# Altium project MSXV_BMS_Carrier_Board_Rev_2.1.PrjPcb
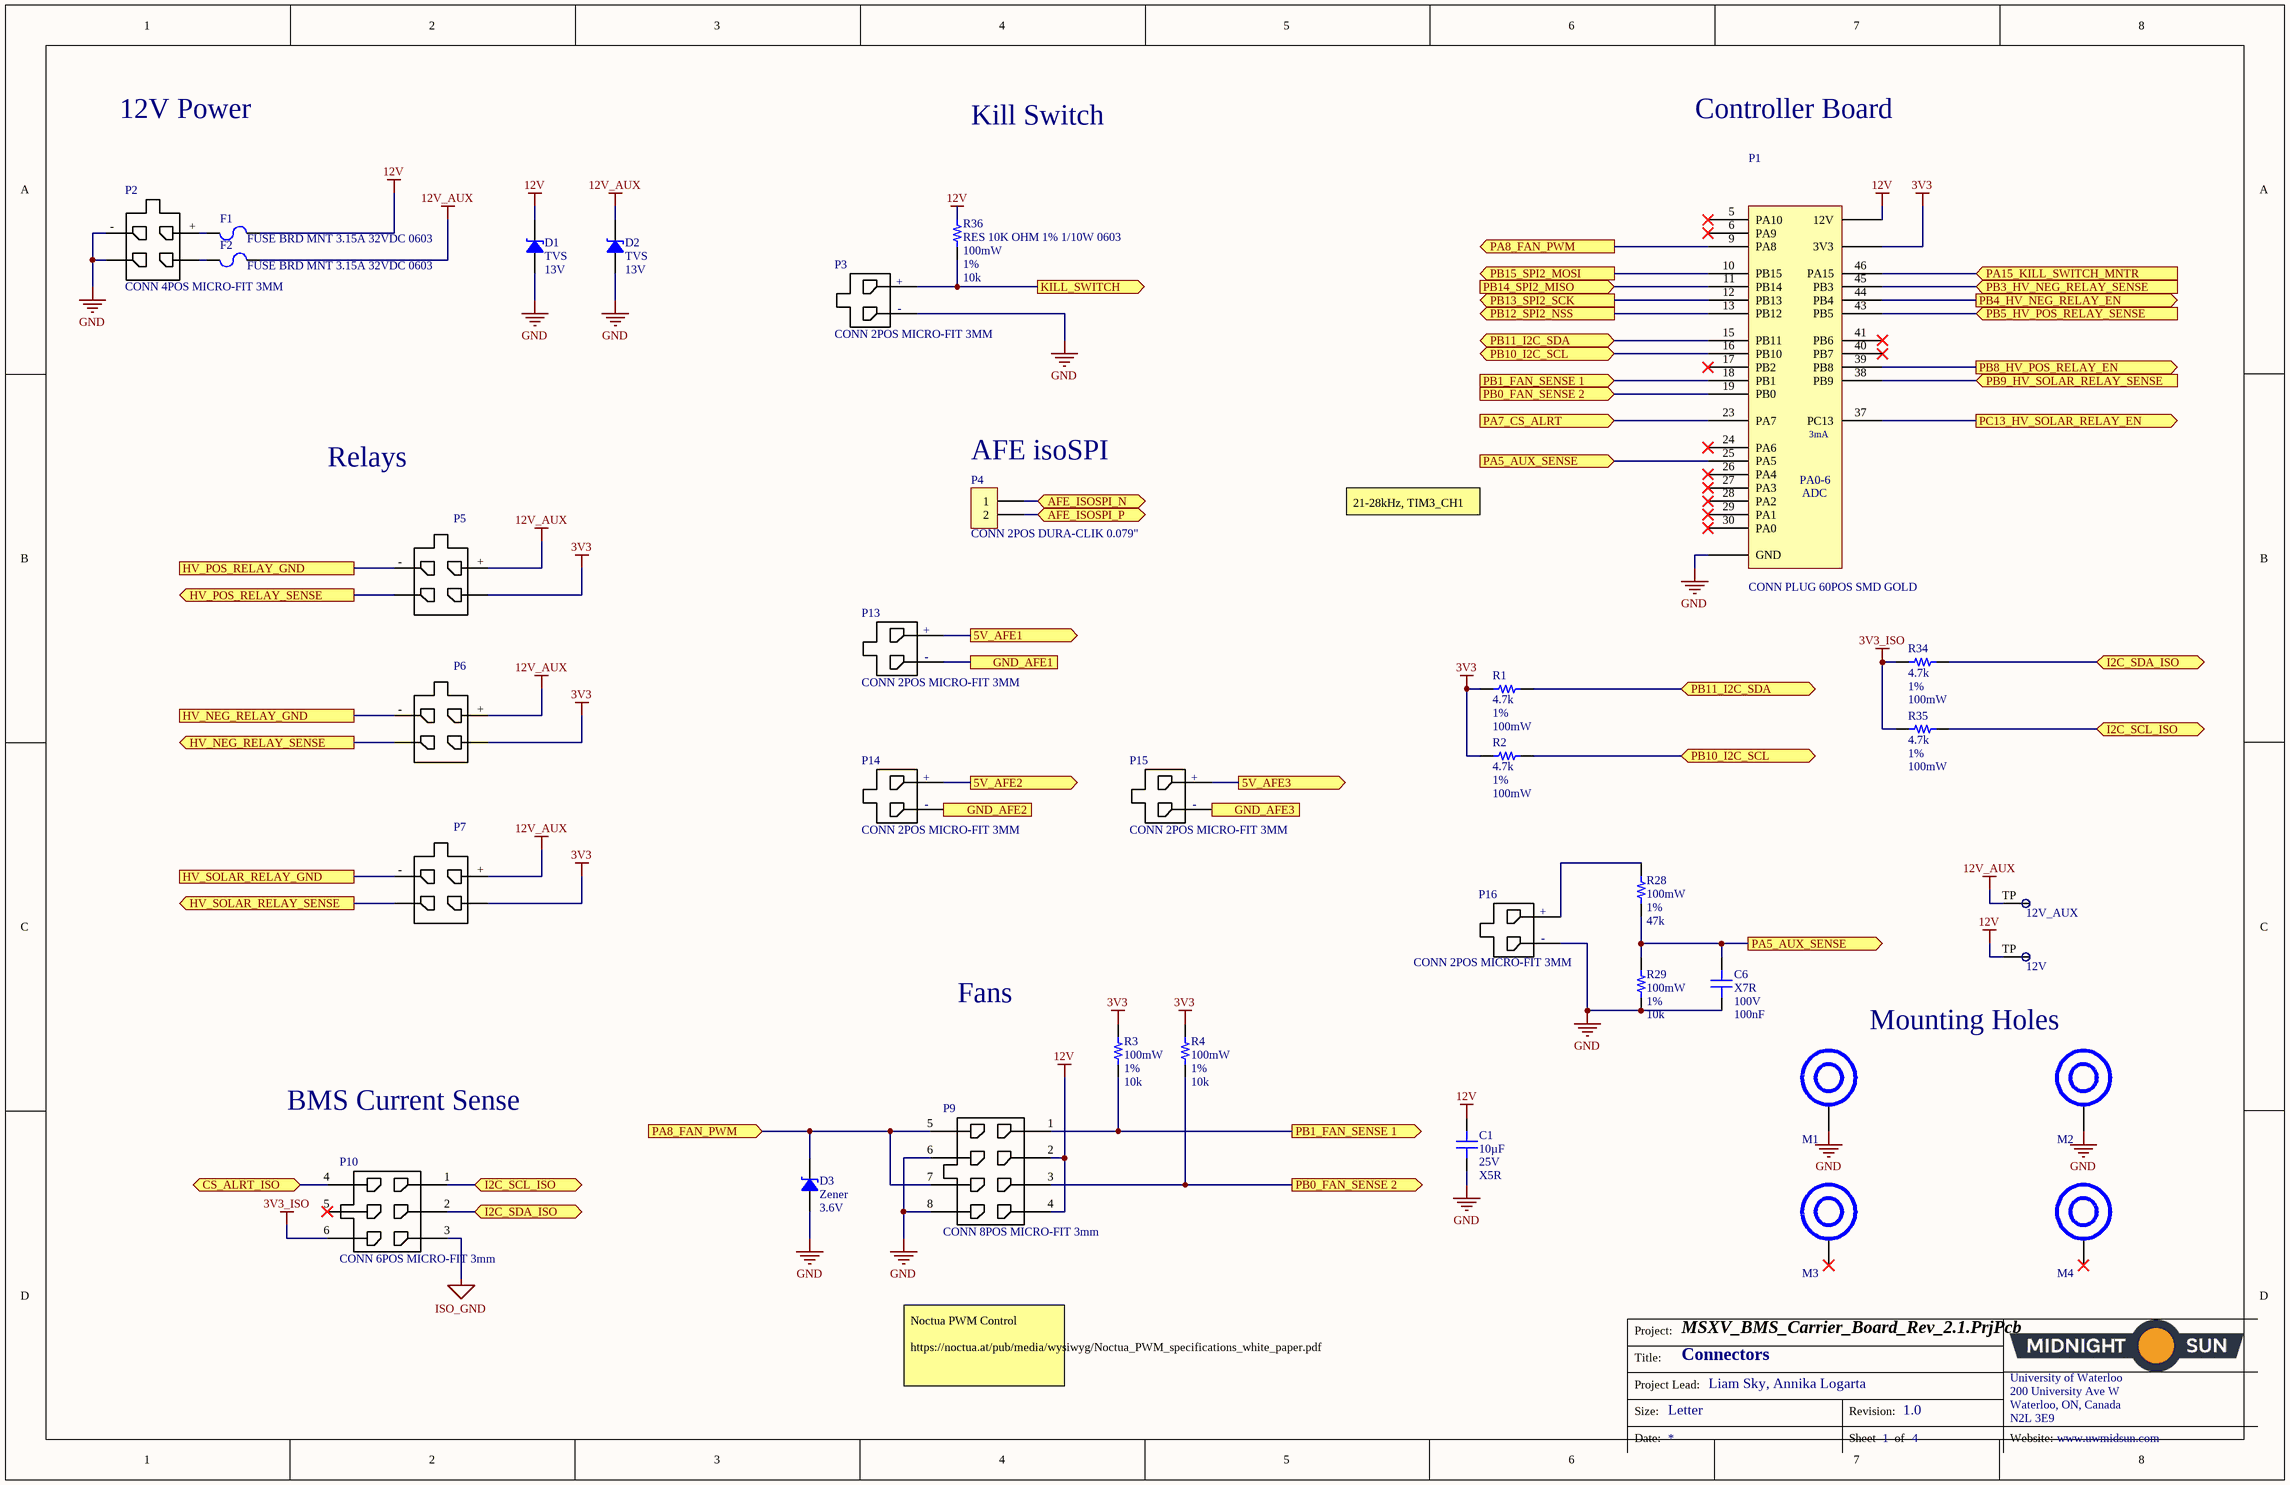
[diagram p0: BMS Carrier - Connectors.SchDoc]
MSPartNumber: MS-ELE0003; ProjectAuthor: Vinai Birbal; ProjectRevision: 1.0
3 sheets, 102 parts. Net scope: flat (ports and power ports of the same name join across sheets).
Board file: BMS Carrier.PcbDoc
Sheets:
  BMS Carrier - Connectors.SchDoc
  BMS Carrier - AFE Interface.SchDoc
  BMS Carrier - Battery Relay Controls.SchDoc

## Sheet BMS Carrier - Connectors.SchDoc: Connectors
size Tabloid; Author: Liam Sky, Annika Logarta; Revision: 1.0; SheetNumber: 1; SheetTotal: 4; Website: www.uwmidsun.com

### Parts
12V  Thru Test Point Top  [Thru Test Point Top]  (value not drawn)  (no BOM)
12V_AUX  Thru Test Point Top  [Thru Test Point Top]  (value not drawn)  (no BOM)
C1  Capacitance: 10µF  Voltage Rating: 25V  Dielectric Code: X5R  [CAP 0603_1608]  (hidden comment: CAP CER 10UF 25V 20% X5R 0603)
C6  Dielectric Code: X7R  Voltage Rating: 100V  Capacitance: 100nF  [CAP 0603_1608]  (hidden comment: CAP CER 0.1UF 100V 10% X7R 0603)
D1  Type: TVS  Reverse Blocking Voltage: 13V  [DO 214AC SMA]  (hidden comment: TVS DIODE 13VWM 21.5VC SMB)
D2  Type: TVS  Reverse Blocking Voltage: 13V  [DO 214AC SMA]  (hidden comment: TVS DIODE 13VWM 21.5VC SMB)
D3  Type: Zener  Breakdown Voltage: 3.6V  [SOD 323]  (hidden comment: DIODE ZENER 3.6V 300MW SOD323)
F1  FUSE BRD MNT 3.15A 32VDC 0603  [FER 0603_1608]
F2  FUSE BRD MNT 3.15A 32VDC 0603  [FER 0603_1608]
M1  HEX STANDOFF M2.5X0.45 BRASS 5MM  [HEX STANDOFF M2.5X0.45 BRASS 5MM-Footprint-1]  (value not drawn)
M2  HEX STANDOFF M2.5X0.45 BRASS 5MM  [HEX STANDOFF M2.5X0.45 BRASS 5MM-Footprint-1]  (value not drawn)
M3  HEX STANDOFF M2.5X0.45 BRASS 5MM  [HEX STANDOFF M2.5X0.45 BRASS 5MM-Footprint-1]  (value not drawn)
M4  HEX STANDOFF M2.5X0.45 BRASS 5MM  [HEX STANDOFF M2.5X0.45 BRASS 5MM-Footprint-1]  (value not drawn)
P1  CONN PLUG 60POS SMD GOLD  [CONN PLUG 60POS SMD GOLD-CONTROLLER BOARD]
P2  CONN 4POS MICRO-FIT 3MM  [CONN 4POS MICROFIT (2x2)]
P3  CONN 2POS MICRO-FIT 3MM  [2POS Molex Microfit 3mm Vert]
P4  CONN 2POS DURA-CLIK 0.079"  [CONN, 2POS Dura-Click]
P5  CONN 4POS MICRO-FIT 3MM  [CONN 4POS MICROFIT (2x2)]  (value not drawn)
P6  CONN 4POS MICRO-FIT 3MM  [CONN 4POS MICROFIT (2x2)]  (value not drawn)
P7  CONN 4POS MICRO-FIT 3MM  [CONN 4POS MICROFIT (2x2)]  (value not drawn)
P9  CONN 8POS MICRO-FIT 3mm  [CONN, 8POS MICRO-FIT]
P10  CONN 6POS MICRO-FIT 3mm  [CONN, 6POS MICRO-FIT 3MM]
P13  CONN 2POS MICRO-FIT 3MM  [2POS Molex Microfit 3mm Vert]
P14  CONN 2POS MICRO-FIT 3MM  [2POS Molex Microfit 3mm Vert]
P15  CONN 2POS MICRO-FIT 3MM  [2POS Molex Microfit 3mm Vert]
P16  CONN 2POS MICRO-FIT 3MM  [2POS Molex Microfit 3mm Vert]
R1  Resistance: 4.7k  Tolerance: 1%  Power Rating: 100mW  [RES 0603_1608]  (hidden comment: RES 4.7K OHM 1% 1/10W 0603)
R2  Resistance: 4.7k  Tolerance: 1%  Power Rating: 100mW  [RES 0603_1608]  (hidden comment: RES 4.7K OHM 1% 1/10W 0603)
R3  Power Rating: 100mW  Tolerance: 1%  Resistance: 10k  [RES 0603_1608]  (hidden comment: RES 10K OHM 1% 1/10W 0603)
R4  Power Rating: 100mW  Tolerance: 1%  Resistance: 10k  [RES 0603_1608]  (hidden comment: RES 10K OHM 1% 1/10W 0603)
R28  Power Rating: 100mW  Tolerance: 1%  Resistance: 47k  [RES 0603_1608]  (hidden comment: RES 47K OHM 1% 1/10W 0603)
R29  Power Rating: 100mW  Tolerance: 1%  Resistance: 10k  [RES 0603_1608]  (hidden comment: RES 10K OHM 1% 1/10W 0603)
R34  Resistance: 4.7k  Tolerance: 1%  Power Rating: 100mW  [RES 0603_1608]  (hidden comment: RES 4.7K OHM 1% 1/10W 0603)
R35  Resistance: 4.7k  Tolerance: 1%  Power Rating: 100mW  [RES 0603_1608]  (hidden comment: RES 4.7K OHM 1% 1/10W 0603)
R36  RES 10K OHM 1% 1/10W 0603  Power Rating: 100mW  Tolerance: 1%  Resistance: 10k  [RES 0603_1608]

### Ports
5V_AFE1 (out), 5V_AFE2 (out), 5V_AFE3 (out), AFE_ISOSPI_N (bidir), AFE_ISOSPI_P (bidir), CS_ALRT_ISO (bidir), GND_AFE1, GND_AFE2, GND_AFE3, HV_NEG_RELAY_GND, HV_NEG_RELAY_SENSE (out), HV_POS_RELAY_GND, HV_POS_RELAY_SENSE (out), HV_SOLAR_RELAY_GND, HV_SOLAR_RELAY_SENSE (out), I2C_SCL_ISO (bidir), I2C_SDA_ISO (bidir), KILL_SWITCH (out), PA5_AUX_SENSE (in), PA5_AUX_SENSE (out), PA7_CS_ALRT (in), PA8_FAN_PWM (in), PA8_FAN_PWM (out), PA15_KILL_SWITCH_MNTR (in), PB0_FAN_SENSE 2 (in), PB0_FAN_SENSE 2 (out), PB1_FAN_SENSE 1 (in), PB1_FAN_SENSE 1 (out), PB3_HV_NEG_RELAY_SENSE (in), PB4_HV_NEG_RELAY_EN (out), PB5_HV_POS_RELAY_SENSE (in), PB8_HV_POS_RELAY_EN (out), PB9_HV_SOLAR_RELAY_SENSE (in), PB10_I2C_SCL (bidir), PB11_I2C_SDA (bidir), PB12_SPI2_NSS (out), PB13_SPI2_SCK (out), PB14_SPI2_MISO (in), PB15_SPI2_MOSI (out), PC13_HV_SOLAR_RELAY_EN (out)

### Nets
3V3: P1.53(3V3) P5.1 P6.1 P7.1 R1.2 R2.2 R3.2 R4.2
3V3_ISO: P10.6 R34.2 R35.2
12V: 12V.TP C1.2 D1.1 F1.1 P1.60(12V) P9.2 P9.4 R36.2
12V_AUX: 12V_AUX.TP D2.1 F2.1 P5.3(+) P6.3(+) P7.3(+)
GND: C1.1 C6.2 D1.2 D2.2 D3.2 M1.0 M2.0 P1.31(GND) P2.2 P2.4(-) P3.2(GND) P9.6 P9.8 P16.2(GND) R29.1
ISO_GND: P10.3
5V_AFE1: P13.1(VCC) ; port 5V_AFE1
5V_AFE2: P14.1(VCC) ; port 5V_AFE2
5V_AFE3: P15.1(VCC) ; port 5V_AFE3
AFE_ISOSPI_N: P4.1 ; port AFE_ISOSPI_N
AFE_ISOSPI_P: P4.2 ; port AFE_ISOSPI_P
CS_ALRT_ISO: P10.4 ; port CS_ALRT_ISO
GND_AFE1: P13.2(GND) ; port GND_AFE1
GND_AFE2: P14.2(GND) ; port GND_AFE2
GND_AFE3: P15.2(GND) ; port GND_AFE3
HV_NEG_RELAY_GND: P6.4(-) ; port HV_NEG_RELAY_GND
HV_NEG_RELAY_SENSE: P6.2 ; port HV_NEG_RELAY_SENSE
HV_POS_RELAY_GND: P5.4(-) ; port HV_POS_RELAY_GND
HV_POS_RELAY_SENSE: P5.2 ; port HV_POS_RELAY_SENSE
HV_SOLAR_RELAY_GND: P7.4(-) ; port HV_SOLAR_RELAY_GND
HV_SOLAR_RELAY_SENSE: P7.2 ; port HV_SOLAR_RELAY_SENSE
I2C_SCL_ISO: P10.1 R35.1 ; port I2C_SCL_ISO
I2C_SDA_ISO: P10.2 R34.1 ; port I2C_SDA_ISO
KILL_SWITCH: P3.1(VCC) R36.1 ; port KILL_SWITCH
PA5_AUX_SENSE: C6.1 P1.25(PA5) R28.1 R29.2 ; port PA5_AUX_SENSE
PA7_CS_ALRT: P1.23(PA7) ; port PA7_CS_ALRT
PA8_FAN_PWM: D3.1 P1.9(PA8) P9.5 P9.7 ; port PA8_FAN_PWM
PA15_KILL_SWITCH_MNTR: P1.46(PA15) ; port PA15_KILL_SWITCH_MNTR
PB0_FAN_SENSE 2: P1.19(PB0) P9.3 R4.1 ; port PB0_FAN_SENSE 2
PB1_FAN_SENSE 1: P1.18(PB1) P9.1 R3.1 ; port PB1_FAN_SENSE 1
PB3_HV_NEG_RELAY_SENSE: P1.45(PB3) ; port PB3_HV_NEG_RELAY_SENSE
PB4_HV_NEG_RELAY_EN: P1.44(PB4) ; port PB4_HV_NEG_RELAY_EN
PB5_HV_POS_RELAY_SENSE: P1.43(PB5) ; port PB5_HV_POS_RELAY_SENSE
PB8_HV_POS_RELAY_EN: P1.39(PB8) ; port PB8_HV_POS_RELAY_EN
PB9_HV_SOLAR_RELAY_SENSE: P1.38(PB9) ; port PB9_HV_SOLAR_RELAY_SENSE
PB10_I2C_SCL: P1.16(PB10) R2.1 ; port PB10_I2C_SCL
PB11_I2C_SDA: P1.15(PB11) R1.1 ; port PB11_I2C_SDA
PB12_SPI2_NSS: P1.13(PB12) ; port PB12_SPI2_NSS
PB13_SPI2_SCK: P1.12(PB13) ; port PB13_SPI2_SCK
PB14_SPI2_MISO: P1.11(PB14) ; port PB14_SPI2_MISO
PB15_SPI2_MOSI: P1.10(PB15) ; port PB15_SPI2_MOSI
PC13_HV_SOLAR_RELAY_EN: P1.37(PC13) ; port PC13_HV_SOLAR_RELAY_EN
NetF1_2: F1.2 P2.3(+)
NetF2_2: F2.2 P2.1
NetP16_1: P16.1(VCC) R28.2

Not connected (* = marked no-connect by the designer): M3 0*; M4 0*; P1 5(PA10)* 6(PA9)* 17(PB2)* 24(PA6)* 26(PA4)* 27(PA3)* 28(PA2)* 29(PA1)* 30(PA0)* 40(PB7)* 41(PB6)*; P10 5*

### Notes on the sheet
- 12V Power
- Kill Switch
- Controller Board
- Relays
- (near P4) AFE isoSPI
- 21-28kHz, TIM3_CH1
- Fans
- Mounting Holes
- BMS Current Sense
- Noctua PWM Control
  https://noctua.at/pub/media/wysiwyg/Noctua_PWM_specifications_white_paper.pdf
- Project:
- Title:
- Size:
- Project Lead:
- Letter
- Revision:
- University of Waterloo
- 200 University Ave W
- Waterloo, ON, Canada
- N2L 3E9
- Date:
- Sheet
- of
- Website:
- (in symbol CMP-002-00093-18) 3mA; PA0-6; ADC
- (in symbol CMP-002-00277-7) +; -

### Library data of the parts
12V 12V_AUX = CMP-003-0090-5: Through Hole Test Point Top Layer; Design Item ID: Thru Test Point
C1 = CMP-013-0018-6: 10µF ±20% 25V Ceramic Capacitor X5R 0603 (1608 Metric); Tolerance: 20%; Case/Package: 0603
C6 = CMP-013-0022-14: Ceramic Capacitor, Multilayer, Ceramic, 100V, 10% +Tol, 10% -Tol, X7R, 15% TC, 0.1uF, Surface Mount, 0603; Case/Package: 0603; Tolerance: 10%
D1 D2 = CMP-004-00068-3: Trans Voltage Suppressor Diode, 600W, 13V V(RWM), Bidirectional, 1 Element, Silicon; Breakdown Voltage: 15.15V; Case/Package: DO-214AC
D3 = CMP-004-00067-3: Zener Diode, 3.6V V(Z), 5.56%, 0.3W, Silicon, Unidirectional; Reverse Blocking Voltage: 3.4V; Case/Package: SOD 323
F1 F2 = CMP-005-00024-1: Electric Fuse, Very Fast Blow, 3.15A, 32VDC, 50A (IR), Surface Mount; Voltage Rating (DC): 32V; Resistance (Cold): 29m; Current Rating: 3.15A; Case/Package: 0603
M1-M4 = CMP-00028-00009-8: Hex Standoff Threaded M2.5x0.45 Brass 0.197" (5.00mm)
P1 = CMP-002-00093-18: Height Rec CONNECTOR-10132798-062100LF / 4800 Rohs Compliant: Yes; pin to pad: 31>1+2+3+4+7+8+14+20+21+22+31+32+33+34+35+36+42 53>48+49+50+51+52+53 55>47+54+55+61+62+63+64 60>56+57+58+59+60; Manufacturer 1: Amphenol ICC (FCI); Connector Type: BOARD CONNECTOR; Gender: Male; Pins: 60; Manufacturer Part Number 1: 10132798-062100LF; RoHS Compliant: Yes
P2 P5-P7 = CMP-002-00278-5: Rectangular Power Connector, 4 Contact(s), Male, Solder Terminal, Plug; Connector Type: Power,Rectangular; Contact Resistance: 10mR; Case/Package: Molex Microfit Receptacle; Max Operating Temperature: 105°C; Contact Gender: Male; RoHS Compliant: Yes; Min Operating Temperature: -40°C
P3 P13-P16 = CMP-002-00277-7: Connector Header Through Hole 2 position 0.118" (3.00mm); Connector Type: Power,Rectangular; Max Operating Temperature: 105°C; RoHS Compliant: Yes; Min Operating Temperature: -40°C
P4 = CMP-007-0044-2: 2 Positions Header, Shrouded Connector 0.079" (2.00mm) Surface Mount, Right Angle Tin; Connector Type: Header
P9 = CMP-007-0004-3: Connector Header Through Hole 6 position 0.118" (3.00mm); Connector Type: Header
P10 = CMP-007-0037-4: Connector Header Through Hole 6 position 0.118" (3.00mm)
R1 R2 R34 R35 = CMP-010-0075-8: Fixed Resistor, Metal Glaze/thick Film, 0.1W, 4700ohm, 75V, 1% +/-Tol, 100ppm/Cel, Surface Mount, 0603; Temperature Coefficient: 100ppm/°C; Case/Package: 0603; Voltage Rating: 75V
R3 R4 R29 R36 = CMP-009-00190-14: 10 ±1% 0.1W, 1/10W Chip Resistor 0603 (1608 Metric) Automotive AEC-Q200 Thick Film; Voltage Rating: 75V; Temperature Coefficient: 100ppm/°C; Case/Package: 0603
R28 = CMP-010-0063-10: Fixed Resistor, Metal Glaze/thick Film, 0.1W, 47000ohm, 75V, 1% +/-Tol, 100ppm/Cel, Surface Mount, 0603; Temperature Coefficient: 100ppm/°C; Case/Package: 0603; Voltage Rating: 75V

## Sheet BMS Carrier - AFE Interface.SchDoc: Interfaces
size Tabloid; Author: Liam Sky, Annika Logarta; Revision: 1.0; SheetNumber: 2; SheetTotal: 4; Website: www.uwmidsun.com
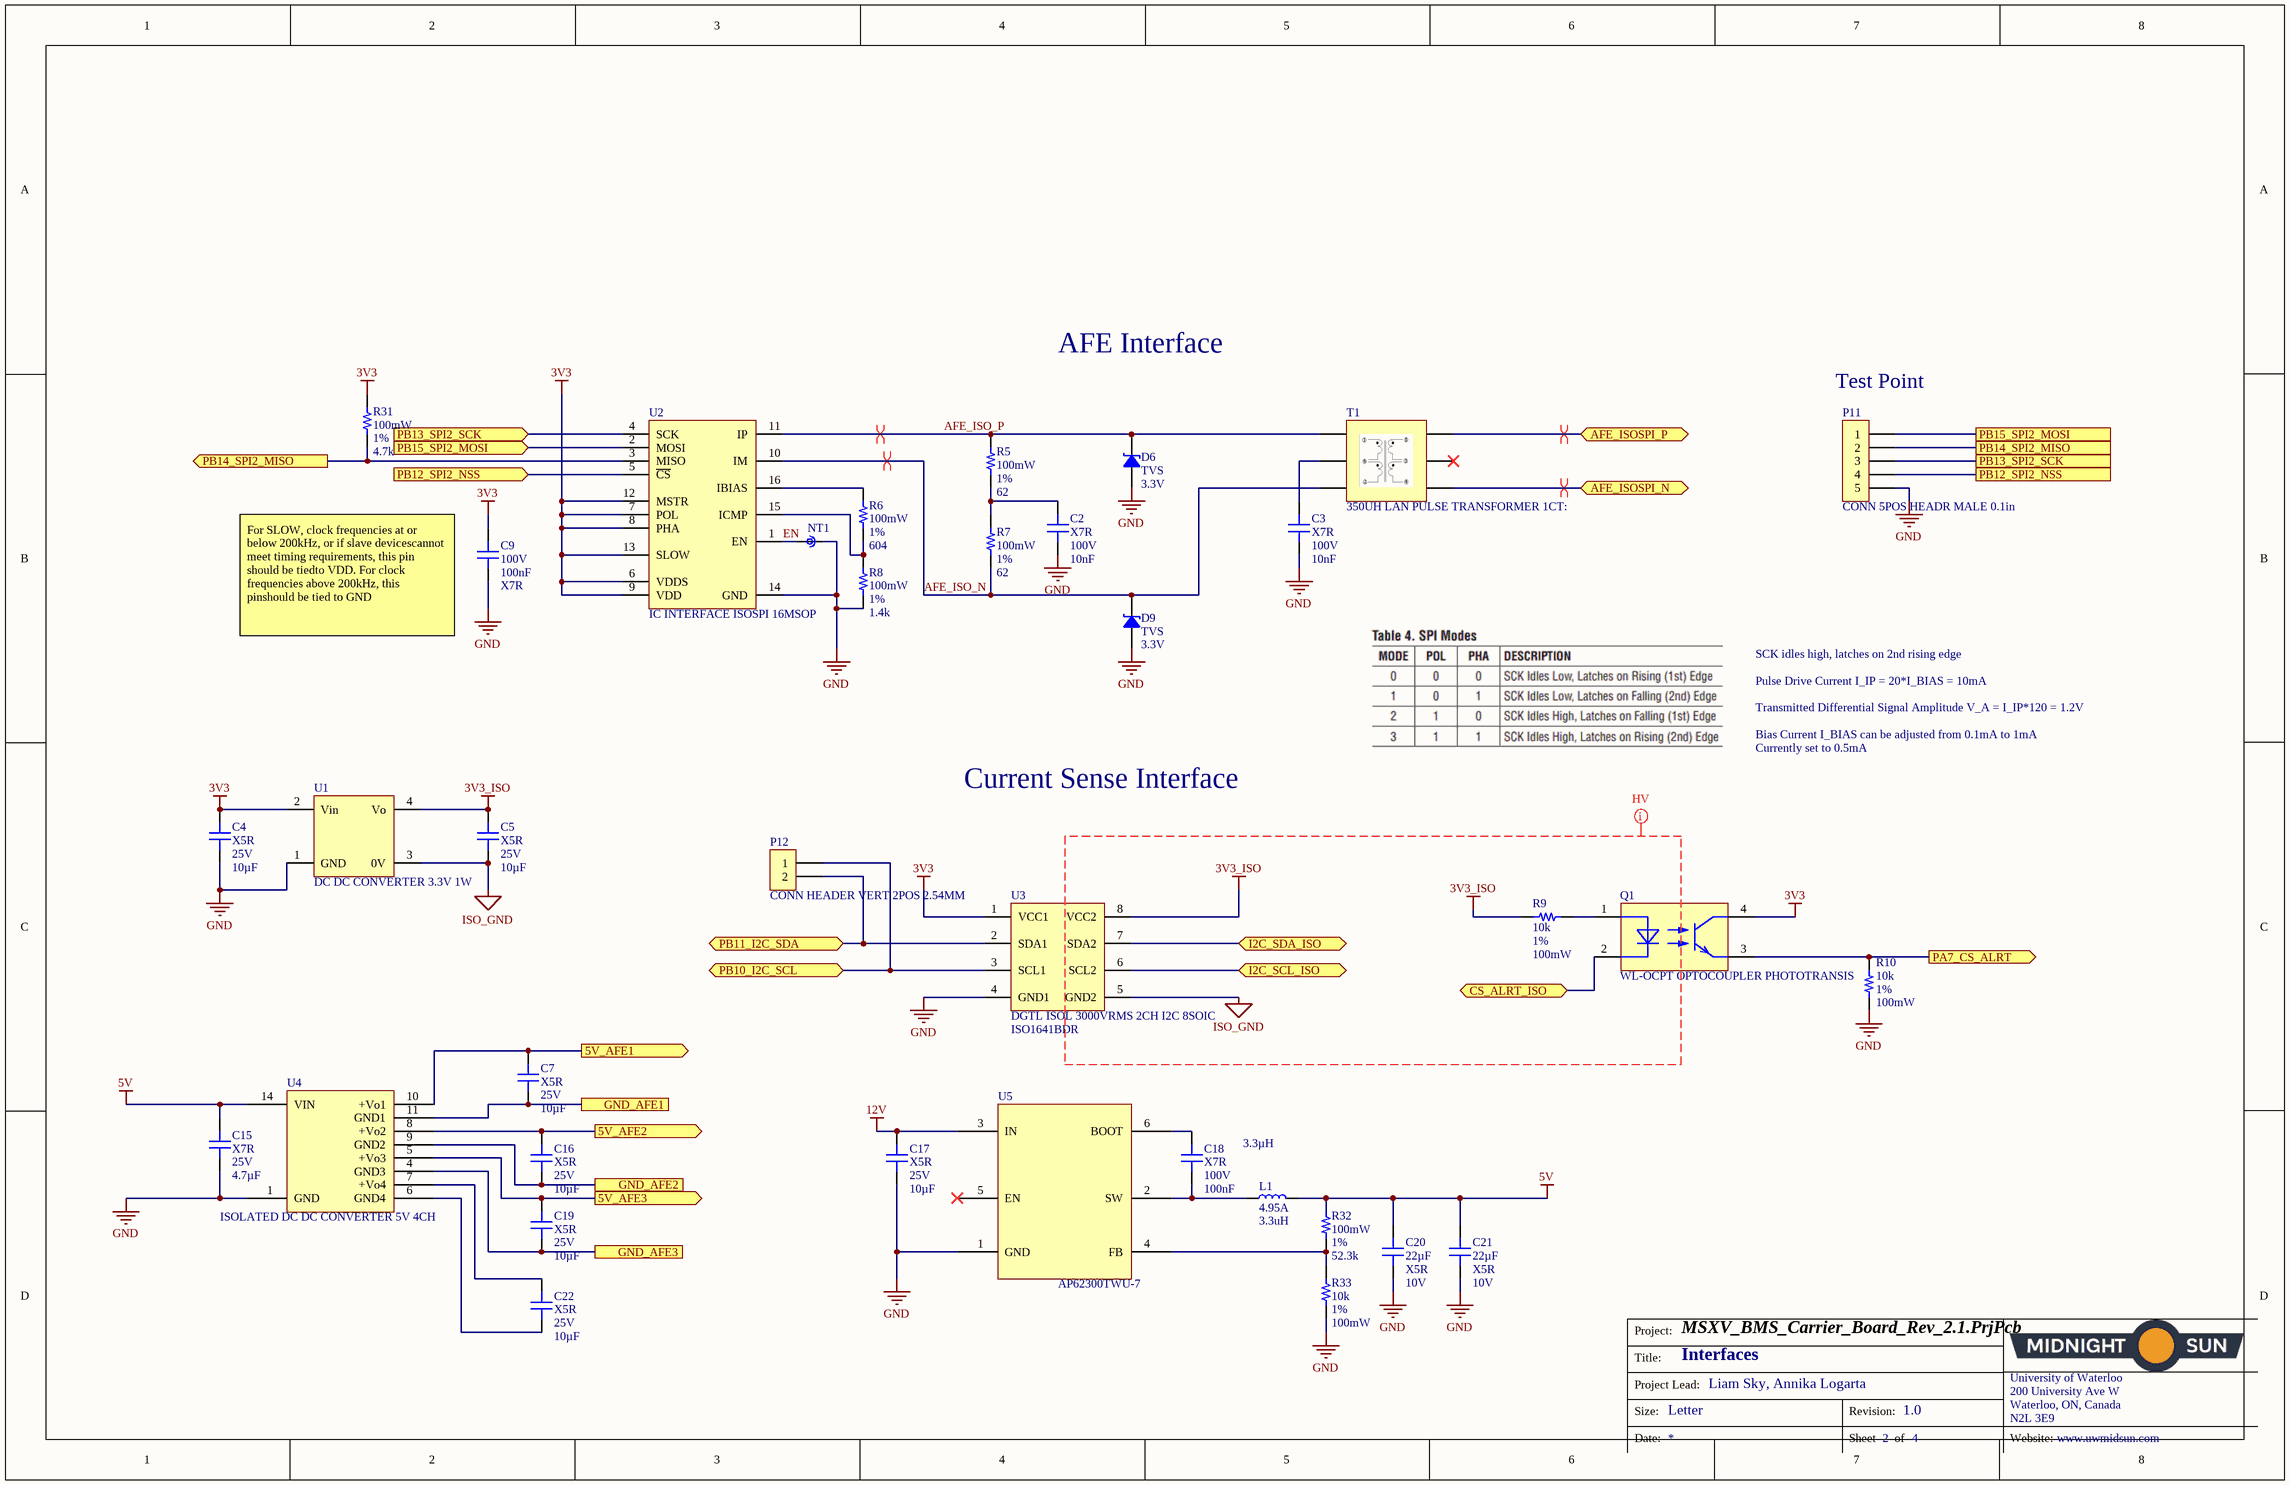
[diagram p1: BMS Carrier - AFE Interface.SchDoc]

### Parts
C2  Dielectric Code: X7R  Voltage Rating: 100V  Capacitance: 10nF  [CAP 0603_1608]  (hidden comment: CAP CER 10NF 100V 10% X7R 0603)
C3  Dielectric Code: X7R  Voltage Rating: 100V  Capacitance: 10nF  [CAP 0603_1608]  (hidden comment: CAP CER 10NF 100V 10% X7R 0603)
C4  Dielectric Code: X5R  Voltage Rating: 25V  Capacitance: 10µF  [CAP 0603_1608]  (hidden comment: CAP CER 10UF 25V 20% X5R 0603)
C5  Dielectric Code: X5R  Voltage Rating: 25V  Capacitance: 10µF  [CAP 0603_1608]  (hidden comment: CAP CER 10UF 25V 20% X5R 0603)
C7  Dielectric Code: X5R  Voltage Rating: 25V  Capacitance: 10µF  [CAP 0603_1608]  (hidden comment: CAP CER 10UF 25V 20% X5R 0603)
C9  Voltage Rating: 100V  Capacitance: 100nF  Dielectric Code: X7R  [CAP 0603_1608]  (hidden comment: CAP CER 0.1UF 100V 10% X7R 0603)
C15  Dielectric Code: X7R  Voltage Rating: 25V  Capacitance: 4.7µF  [CAP 0603_1608]  (hidden comment: CAP CER 4.7UF 25V 10% X5R 0603)
C16  Dielectric Code: X5R  Voltage Rating: 25V  Capacitance: 10µF  [CAP 0603_1608]  (hidden comment: CAP CER 10UF 25V 20% X5R 0603)
C17  Dielectric Code: X5R  Voltage Rating: 25V  Capacitance: 10µF  [CAP 0603_1608]  (hidden comment: CAP CER 10UF 25V 20% X5R 0603)
C18  Dielectric Code: X7R  Voltage Rating: 100V  Capacitance: 100nF  [CAP 0603_1608]  (hidden comment: CAP CER 0.1UF 100V 10% X7R 0603)
C19  Dielectric Code: X5R  Voltage Rating: 25V  Capacitance: 10µF  [CAP 0603_1608]  (hidden comment: CAP CER 10UF 25V 20% X5R 0603)
C20  Capacitance: 22µF  Dielectric Code: X5R  Voltage Rating: 10V  [CAP 0603_1608]  (hidden comment: CAP CER 22UF 10V 20% X5R 0603)
C21  Capacitance: 22µF  Dielectric Code: X5R  Voltage Rating: 10V  [CAP 0603_1608]  (hidden comment: CAP CER 22UF 10V 20% X5R 0603)
C22  Dielectric Code: X5R  Voltage Rating: 25V  Capacitance: 10µF  [CAP 0603_1608]  (hidden comment: CAP CER 10UF 25V 20% X5R 0603)
D6  Type: TVS  Reverse Blocking Voltage: 3.3V  [SOD 323]  (hidden comment: TVS DIODE 3.3VWM 10VC SOD323)
D9  Type: TVS  Reverse Blocking Voltage: 3.3V  [SOD 323]  (hidden comment: TVS DIODE 3.3VWM 10VC SOD323)
L1  value 3.3µH  Rated Current-Max: 4.95A  Inductance-Nom (L): 3.3uH  [INDUCTOR TDK 6x6]  (hidden comment: FIXED IND 3.3UH 4.95A 30MOHM SMD)
NT1  Net Tie 5mil  [Net Tie]  (value not drawn)  (net tie, no BOM)
P11  CONN 5POS HEADR MALE 0.1in  [CONN, 5POS HEADR 0.1"]
P12  CONN HEADER VERT 2POS 2.54MM  [HDR1X2]  (no BOM)
Q1  WL-OCPT OPTOCOUPLER PHOTOTRANSIS  [WL-OCPT_LSOP4]
R5  Power Rating: 100mW  Tolerance: 1%  Resistance: 62  [RES 0603_1608]  (hidden comment: RES 62 OHM 1% 1/10W 0603)
R6  Power Rating: 100mW  Tolerance: 1%  Resistance: 604  [RES 0603_1608]  (hidden comment: RES 604 OHM 1% 1/10W 0603)
R7  Power Rating: 100mW  Tolerance: 1%  Resistance: 62  [RES 0603_1608]  (hidden comment: RES 62 OHM 1% 1/10W 0603)
R8  Power Rating: 100mW  Tolerance: 1%  Resistance: 1.4k  [RES 0603_1608]  (hidden comment: RES 1.4K OHM 1% 1/10W 0603)
R9  Resistance: 10k  Tolerance: 1%  Power Rating: 100mW  [RES 0603_1608]  (hidden comment: RES 10K OHM 1% 1/10W 0603)
R10  Resistance: 10k  Tolerance: 1%  Power Rating: 100mW  [RES 0603_1608]  (hidden comment: RES 10K OHM 1% 1/10W 0603)
R31  Power Rating: 100mW  Tolerance: 1%  Resistance: 4.7k  [RES 0603_1608]  (hidden comment: RES 4.7K OHM 1% 1/10W 0603)
R32  Power Rating: 100mW  Tolerance: 1%  Resistance: 52.3k  [RES 0603_1608]  (hidden comment: RES 52.3K OHM 1% 1/10W 0603)
R33  Resistance: 10k  Tolerance: 1%  Power Rating: 100mW  [RES 0603_1608]  (hidden comment: RES 10K OHM 1% 1/10W 0603)
T1  350UH LAN PULSE TRANSFORMER 1CT:  [TXF453229NF-121-Footprint-1]
U1  DC DC CONVERTER 3.3V 1W  [DCDC ISOLATED 12V 1W-Footprint-1]
U2  IC INTERFACE ISOSPI 16MSOP  [MSOP 16]
U3  DGTL ISOL 3000VRMS 2CH I2C 8SOIC  Manufacturer Part Number: ISO1641BDR  [SOIC 8]
U4  ISOLATED DC DC CONVERTER 5V 4CH  [DIP14]
U5  Manufacturer Part Number: AP62300TWU-7  [TSOT26]  (hidden comment: CMP-031-00049-1)

### Ports
5V_AFE1 (out), 5V_AFE2 (out), 5V_AFE3 (out), AFE_ISOSPI_N (bidir), AFE_ISOSPI_P (bidir), CS_ALRT_ISO (bidir), GND_AFE1, GND_AFE2, GND_AFE3, I2C_SCL_ISO (bidir), I2C_SDA_ISO (bidir), PA7_CS_ALRT (out), PB10_I2C_SCL (bidir), PB11_I2C_SDA (bidir), PB12_SPI2_NSS, PB12_SPI2_NSS (in), PB13_SPI2_SCK, PB13_SPI2_SCK (in), PB14_SPI2_MISO, PB14_SPI2_MISO (out), PB15_SPI2_MOSI, PB15_SPI2_MOSI (in)

### Nets
3V3: C4.2 C9.2 Q1.4(Collector) R31.1 U1.2(Vin) U2.6(VDDS) U2.7(POL) U2.8(PHA) U2.9(VDD) U2.12(MSTR) U2.13(SLOW) U3.1(VCC1)
3V3_ISO: C5.2 R9.2 U1.4(Vo) U3.8(VCC2)
5V: C15.1 C20.2 C21.2 L1.2 R32.2 U4.14(VIN)
12V: C17.2 U5.3(IN)
GND: C2.1 C3.1 C4.1 C9.1 C15.2 C17.1 C20.1 C21.1 D6.2 D9.2 NT1.2 P11.5 R8.1 R10.1 R33.1 U1.1(GND) U2.14(GND) U3.4(GND1) U4.1(GND) U5.1(GND)
ISO_GND: C5.1 U1.3(0V) U3.5(GND2)
5V_AFE1: C7.2 U4.10(+Vo1) ; port 5V_AFE1
5V_AFE2: C16.2 U4.8(+Vo2) ; port 5V_AFE2
5V_AFE3: C19.2 U4.5(+Vo3) ; port 5V_AFE3
AFE_ISO_N: D9.1 R7.1 T1.2 U2.10(IM)
AFE_ISO_P: D6.1 R5.2 T1.1 U2.11(IP)
AFE_ISOSPI_N: T1.4 ; port AFE_ISOSPI_N
AFE_ISOSPI_P: T1.5 ; port AFE_ISOSPI_P
CS_ALRT_ISO: Q1.2(Cathode) ; port CS_ALRT_ISO
EN: NT1.1 U2.1(EN)
GND_AFE1: C7.1 U4.11(GND1) ; port GND_AFE1
GND_AFE2: C16.1 U4.9(GND2) ; port GND_AFE2
GND_AFE3: C19.1 U4.4(GND3) ; port GND_AFE3
I2C_SCL_ISO: U3.6(SCL2) ; port I2C_SCL_ISO
I2C_SDA_ISO: U3.7(SDA2) ; port I2C_SDA_ISO
PA7_CS_ALRT: Q1.3(Emitter) R10.2 ; port PA7_CS_ALRT
PB10_I2C_SCL: P12.1 U3.3(SCL1) ; port PB10_I2C_SCL
PB11_I2C_SDA: P12.2 U3.2(SDA1) ; port PB11_I2C_SDA
PB12_SPI2_NSS: P11.4 U2.5(~{CS}) ; port PB12_SPI2_NSS
PB13_SPI2_SCK: P11.3 U2.4(SCK) ; port PB13_SPI2_SCK
PB14_SPI2_MISO: P11.2 R31.2 U2.3(MISO) ; port PB14_SPI2_MISO
PB15_SPI2_MOSI: P11.1 U2.2(MOSI) ; port PB15_SPI2_MOSI
NetC2_2: C2.2 R5.1 R7.2
NetC3_2: C3.2 T1.6
NetC18_1: C18.1 L1.1 U5.2(SW)
NetC18_2: C18.2 U5.6(BOOT)
NetC22_1: C22.1 U4.6(GND4)
NetC22_2: C22.2 U4.7(+Vo4)
NetQ1_1: Q1.1(Anode) R9.1
NetR6_1: R6.1 R8.2 U2.15(ICMP)
NetR6_2: R6.2 U2.16(IBIAS)
NetR32_1: R32.1 R33.2 U5.4(FB)

Not connected (* = marked no-connect by the designer): T1 3(1)*; U5 5(EN)*

### Layout directives
differential pair: AFE_ISO_N, AFE_ISO_P, AFE_ISOSPI_N, AFE_ISOSPI_P
mark named HV: 3V3_ISO, ISO_GND

### Notes on the sheet
- AFE Interface
- (near P11) Test Point
- (near C9) For SLOW, clock frequencies at or below 200kHz, or if slave devicescannot meet timing requirements, this pin should be tiedto VDD. For clock frequencies above 200kHz, this pinshould be tied to GND
- Pulse Drive Current I_IP = 20*I_BIAS = 10mA
- SCK idles high, latches on 2nd rising edge
- Bias Current I_BIAS can be adjusted from 0.1mA to 1mA
- Currently set to 0.5mA
- Transmitted Differential Signal Amplitude V_A = I_IP*120 = 1.2V
- Current Sense Interface
- Project:
- Title:
- Size:
- Project Lead:
- Letter
- Revision:
- University of Waterloo
- 200 University Ave W
- Waterloo, ON, Canada
- N2L 3E9
- Date:
- Sheet
- of
- Website:

### Library data of the parts
C2 C3 = CMP-001-00137-3: Ceramic Capacitor, Multilayer, Ceramic, 100V, 10% +Tol, 10% -Tol, X7R, 15% TC, 0.01uF, Surface Mount, 0603; Tolerance: 10%; Case/Package: 0603
C4 C5 C7 C16 C17 C19 C22 = CMP-013-0018-6: as C1 on sheet BMS Carrier - Connectors; Case/Package: 0603; Tolerance: 20%
C9 C18 = CMP-013-0022-14: as C6 on sheet BMS Carrier - Connectors; Tolerance: 10%; Case/Package: 0603
C15 = CMP-013-0104-5: 4.7µF ±10% 25V Ceramic Capacitor X5R 0603 (1608 Metric); Case/Package: 0603; Tolerance: 10%
C20 C21 = CMP-013-0021-7: Ceramic Capacitor, Multilayer, Ceramic, 10V, 20% +Tol, 20% -Tol, X5R, 15% TC, 22uF, Surface Mount, 0603; Tolerance: 20%; Case/Package: 0603
D6 D9 = CMP-004-00065-3: Trans Voltage Suppressor Diode, 3.3V V(RWM), Unidirectional, 1 Element, Silicon; Breakdown Voltage: 6V; Case/Package: SOD-323
L1 = CMP-006-00030-2: General Purpose Inductor, 3.3uH, 30%, 1 Element, Ferrite-Core, SMD, 2424; Self Resonant Frequency: 0Hz; Shielding: Shielded; Package Height: 4.5mm; Inductor Application: POWER INDUCTOR; Package Length: 6mm; Shape/Size Description: RECTANGULAR PACKAGE; DC Resistance (DCR): 23mR; Number of Functions: 1; Test Frequency: 100kHz; Max Operating Temperature: 105°C; Source: Local.SchLib; Case/Package: Nonstandard; RoHS Compliant: Yes; Packaging: Tape and Reel; Package Style: SMTMeter; REACH SVHC: Yes; Pins: 2; Design Item ID: FIXED IND 3.3UH 4.95A 30MOHM SMD; Inductor Type: GENERAL PURPOSE INDUCTOR; RoHS: Yes; Surface Mount: Yes; Pricing 1: 1=0.51000, 10=0.44300, 25=0.41120, 50=0.34780, 100=0.31620, 250=0.29728, 500=0.26564 (USD); Stock 1: 128298; Termination: One Surface; Terminal Placement: Dual Ended; Tolerance: 30%; Package Width: 6mm; Min Operating Temperature: -40°C
NT1 = CMP-009-00116-5: Case/Package: Net Tie
P11 = CMP-007-0050-1: 5 Positions Header, Breakaway Connector 0.100" (2.54mm) Through Hole Tin; Manufacturer Part Number 1: 0022284050; Manufacturer 1: Molex; Max Voltage Rating (DC): 250V; Description 1: Conn Unshrouded Header HDR 5 POS 2.54mm Solder ST Thru-Hole KK® Bag; Connector Type: Male Pin; Number of Contacts: 5; Contact Resistance: 20mR; ComponentLink1URL: https://datasheet.ciiva.com/6814/022284363-sd-6814049.pdf; Housing Colour: Black; Colour: Black; ComponentLink3Description: https://datasheet.ciiva.com/15217/getdatasheetpartid-256138-15217709.pdf; Depth: 2.49mm; Length: 12.7mm; Contact Plating: Nickel,Tin; ComponentLink2Description: https://datasheet.ciiva.com/14804/179390022284050-pcb-headers-14804361.pdf; Contact Material: Bronze,Brass; Housing Material: Nylon; Min Operating Temperature: 0°C; Pitch: 2.54mm; Contact Mating Length: 0.24inch; Pricing 1: 1=0.22, 10=0.21, 25=0.1796, 50=0.157, 100=0.1459, 250=0.129, 500=0.1234 (USD); Orientation: Straight; Source: Schematic Diagrams.SchLib; Gender: Male; Number of Rows: 1; ComponentLink2URL: https://datasheet.ciiva.com/14804/179390022284050-pcb-headers-14804361.pdf; Number of Positions: 5; ComponentLink3URL: https://datasheet.ciiva.com/15217/getdatasheetpartid-256138-15217709.pdf; ComponentLink1Description: https://datasheet.ciiva.com/6814/022284363-sd-6814049.pdf; Termination: Solder; Packaging: Bulk; Mount: Through Hole; Max Voltage Rating (AC): 250V; Stock 1: 3161; Max Operating Temperature: 75°C; Design Item ID: CONN 5POS HEADR MALE 0.1in
P12 = CMP-002-00166-3: Connector Header Through Hole 2 position 0.100" (2.54mm); Pins: 2
Q1 = CMP-00026-00001-1: Optocoupler, Transistor, 80V, Lsop-4 Rohs Compliant: Yes; RoHS Compliant: Yes
R5 R7 = CMP-010-0025-8: Fixed Resistor, Metal Glaze/thick Film, 0.1W, 62ohm, 75V, 1% +/-Tol, 100ppm/Cel, Surface Mount, 0603; Temperature Coefficient: 100ppm/°C; Voltage Rating: 75V; Case/Package: 0603
R6 = CMP-00038-1: Fixed Resistor, Metal Glaze/thick Film, 0.1W, 604ohm, 75V, 1% +/-Tol, 100ppm/Cel, Surface Mount, 0603; Temperature Coefficient: 100ppm/°C; Case/Package: 0603; Voltage Rating: 75V
R8 = CMP-00039-1: Fixed Resistor, Metal Glaze/thick Film, 0.1W, 1400ohm, 75V, 1% +/-Tol, 100ppm/Cel, Surface Mount, 0603; Temperature Coefficient: 100ppm/°C; Case/Package: 0603; Voltage Rating: 75V
R9 R10 R33 = CMP-009-00190-14: as R3 on sheet BMS Carrier - Connectors; Case/Package: 0603
R31 = CMP-010-0075-8: as R1 on sheet BMS Carrier - Connectors; Case/Package: 0603; Voltage Rating: 75V
R32 = CMP-00010-4: Fixed Resistor, Metal Glaze/thick Film, 0.1W, 52300ohm, 75V, 1% +/-Tol, 100ppm/Cel, Surface Mount, 0603; Temperature Coefficient: 100ppm/°C; Case/Package: 0603; Voltage Rating: 75V
T1 = CMP-012-00000-2: 350µH LAN Pulse Transformer 1:1 Surface Mount
U1 = CMP-019-00064-2: Max Supply Voltage: 3.6V; Min Supply Voltage: 3V; Output Voltage: 3.3V
U2 = CMP-015-00019-2: Isolated Communications Interface 3.3V/5V Automotive 16-Pin MSOP Tube; Manufacturer Part Number: LTC6820IMS#PBF; Min Supply Voltage: 2.7V; Max Supply Voltage: 5.5V; Case/Package: MSOP 16
U3 = CMP-015-00024-2: I²C Digital Isolator 3000Vrms 2 Channel 1Mbps 50kV/µs CMTI 8-SOIC (0.154", 3.90mm Width); Min Supply Voltage: 3V; Max Supply Voltage: 5.5V; Case/Package: SOIC 8
U4 = CMP-015-00027-4: Isolated Module DC DC Converter 4 Output 5V 5V 5V 5V 50mA, 50mA, 50mA, 50mA 4.5V - 5.5V Input; Min Supply Voltage: 4.5V; Max Supply Voltage: 5.5V; Case/Package: Tube
U5 = CMP-031-00049-1: Buck Switching Regulator IC Positive Adjustable 0.8V 1 Output 3A SOT-23-6 Thin, TSOT-23-6; Manufacturer: Diodes; RoHS: Yes; Category: Voltage Regulators - Switching; Stock 1: 275295; Pricing 1: 1=0.53000, 10=0.42900, 25=0.39280, 100=0.29240, 250=0.26496, 500=0.21930, 1000=0.16447 (USD); Design Item ID: IC REG BUCK ADJ 3A TSOT26; Source: Local.SchLib

## Sheet BMS Carrier - Battery Relay Controls.SchDoc: Relay Control
size Tabloid; Author: Liam Sky, Annika Logarta; Revision: 1.0; SheetNumber: 4; SheetTotal: 4; Website: www.uwmidsun.com
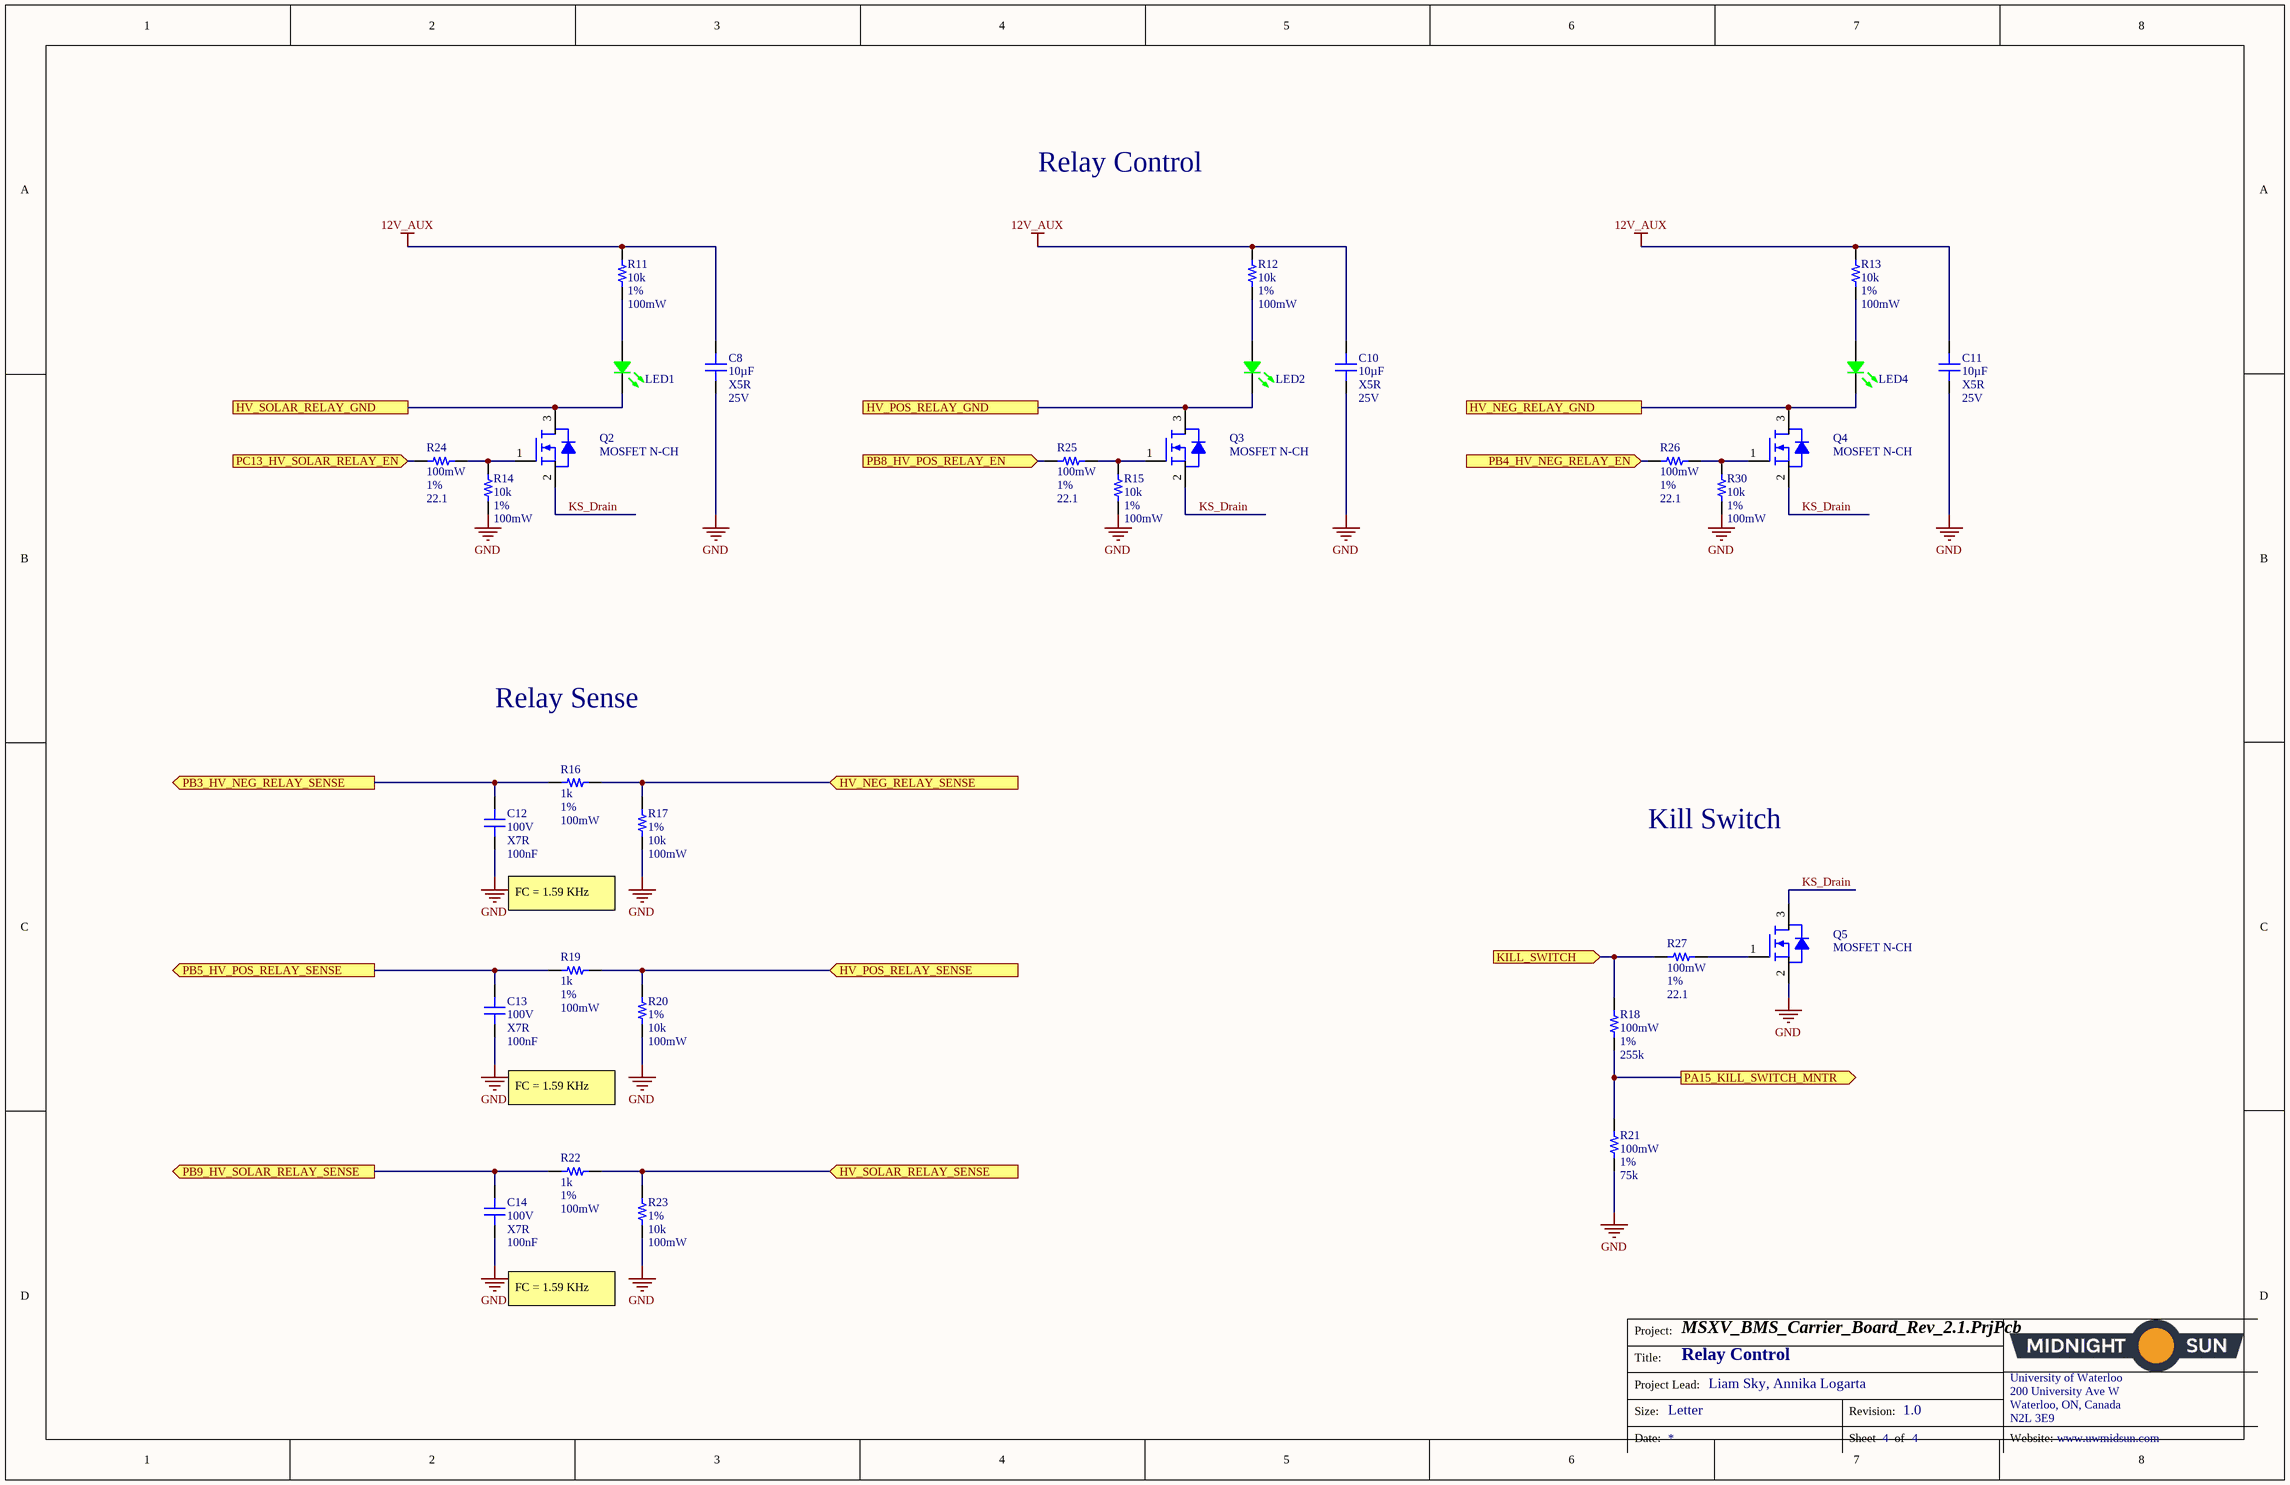
[diagram p2: BMS Carrier - Battery Relay Controls.SchDoc]

### Parts
C8  Capacitance: 10µF  Dielectric Code: X5R  Voltage Rating: 25V  [CAP 0603_1608]  (hidden comment: CAP CER 10UF 25V 20% X5R 0603)
C10  Capacitance: 10µF  Dielectric Code: X5R  Voltage Rating: 25V  [CAP 0603_1608]  (hidden comment: CAP CER 10UF 25V 20% X5R 0603)
C11  Capacitance: 10µF  Dielectric Code: X5R  Voltage Rating: 25V  [CAP 0603_1608]  (hidden comment: CAP CER 10UF 25V 20% X5R 0603)
C12  Voltage Rating: 100V  Dielectric Code: X7R  Capacitance: 100nF  [CAP 0603_1608]  (hidden comment: CAP CER 0.1UF 100V 10% X7R 0603)
C13  Voltage Rating: 100V  Dielectric Code: X7R  Capacitance: 100nF  [CAP 0603_1608]  (hidden comment: CAP CER 0.1UF 100V 10% X7R 0603)
C14  Voltage Rating: 100V  Dielectric Code: X7R  Capacitance: 100nF  [CAP 0603_1608]  (hidden comment: CAP CER 0.1UF 100V 10% X7R 0603)
LED1  LED GREEN CLEAR 2V 0603  [LED 0603_1608]  (value not drawn)
LED2  LED GREEN CLEAR 2V 0603  [LED 0603_1608]  (value not drawn)
LED4  LED GREEN CLEAR 2V 0603  [LED 0603_1608]  (value not drawn)
Q2  MOSFET N-CH  [SOT 23-3]
Q3  MOSFET N-CH  [SOT 23-3]
Q4  MOSFET N-CH  [SOT 23-3]
Q5  MOSFET N-CH  [SOT 23-3]
R11  Resistance: 10k  Tolerance: 1%  Power Rating: 100mW  [RES 0603_1608]  (hidden comment: RES 10K OHM 1% 1/10W 0603)
R12  Resistance: 10k  Tolerance: 1%  Power Rating: 100mW  [RES 0603_1608]  (hidden comment: RES 10K OHM 1% 1/10W 0603)
R13  Resistance: 10k  Tolerance: 1%  Power Rating: 100mW  [RES 0603_1608]  (hidden comment: RES 10K OHM 1% 1/10W 0603)
R14  Resistance: 10k  Tolerance: 1%  Power Rating: 100mW  [RES 0603_1608]  (hidden comment: RES 10K OHM 1% 1/10W 0603)
R15  Resistance: 10k  Tolerance: 1%  Power Rating: 100mW  [RES 0603_1608]  (hidden comment: RES 10K OHM 1% 1/10W 0603)
R16  Resistance: 1k  Tolerance: 1%  Power Rating: 100mW  [RES 0603_1608]  (hidden comment: RES 1K OHM 1% 1/10W 0603)
R17  Tolerance: 1%  Resistance: 10k  Power Rating: 100mW  [RES 0603_1608]  (hidden comment: RES 10K OHM 1% 1/10W 0603)
R18  Power Rating: 100mW  Tolerance: 1%  Resistance: 255k  [RES 0603_1608]  (hidden comment: RES 255K OHM 1% 1/10W 0603)
R19  Resistance: 1k  Tolerance: 1%  Power Rating: 100mW  [RES 0603_1608]  (hidden comment: RES 1K OHM 1% 1/10W 0603)
R20  Tolerance: 1%  Resistance: 10k  Power Rating: 100mW  [RES 0603_1608]  (hidden comment: RES 10K OHM 1% 1/10W 0603)
R21  Power Rating: 100mW  Tolerance: 1%  Resistance: 75k  [RES 0603_1608]  (hidden comment: RES 75K OHM 1% 1/10W 0603)
R22  Resistance: 1k  Tolerance: 1%  Power Rating: 100mW  [RES 0603_1608]  (hidden comment: RES 1K OHM 1% 1/10W 0603)
R23  Tolerance: 1%  Resistance: 10k  Power Rating: 100mW  [RES 0603_1608]  (hidden comment: RES 10K OHM 1% 1/10W 0603)
R24  Power Rating: 100mW  Tolerance: 1%  Resistance: 22.1  [RES 0603_1608]  (hidden comment: RES 22.1 OHM 1% 1/10W 0603)
R25  Power Rating: 100mW  Tolerance: 1%  Resistance: 22.1  [RES 0603_1608]  (hidden comment: RES 22.1 OHM 1% 1/10W 0603)
R26  Power Rating: 100mW  Tolerance: 1%  Resistance: 22.1  [RES 0603_1608]  (hidden comment: RES 22.1 OHM 1% 1/10W 0603)
R27  Power Rating: 100mW  Tolerance: 1%  Resistance: 22.1  [RES 0603_1608]  (hidden comment: RES 22.1 OHM 1% 1/10W 0603)
R30  Resistance: 10k  Tolerance: 1%  Power Rating: 100mW  [RES 0603_1608]  (hidden comment: RES 10K OHM 1% 1/10W 0603)

### Ports
HV_NEG_RELAY_GND, HV_NEG_RELAY_SENSE (in), HV_POS_RELAY_GND, HV_POS_RELAY_SENSE (in), HV_SOLAR_RELAY_GND, HV_SOLAR_RELAY_SENSE (in), KILL_SWITCH (in), PA15_KILL_SWITCH_MNTR (out), PB3_HV_NEG_RELAY_SENSE (out), PB4_HV_NEG_RELAY_EN (in), PB5_HV_POS_RELAY_SENSE (out), PB8_HV_POS_RELAY_EN (in), PB9_HV_SOLAR_RELAY_SENSE (out), PC13_HV_SOLAR_RELAY_EN (in)

### Nets
12V_AUX: C8.2 C10.2 C11.2 R11.2 R12.2 R13.2
GND: C8.1 C10.1 C11.1 C12.1 C13.1 C14.1 Q5.2(S) R14.1 R15.1 R17.1 R20.1 R21.1 R23.1 R30.1
HV_NEG_RELAY_GND: LED4.1 Q4.3(D) ; port HV_NEG_RELAY_GND
HV_NEG_RELAY_SENSE: R16.2 R17.2 ; port HV_NEG_RELAY_SENSE
HV_POS_RELAY_GND: LED2.1 Q3.3(D) ; port HV_POS_RELAY_GND
HV_POS_RELAY_SENSE: R19.2 R20.2 ; port HV_POS_RELAY_SENSE
HV_SOLAR_RELAY_GND: LED1.1 Q2.3(D) ; port HV_SOLAR_RELAY_GND
HV_SOLAR_RELAY_SENSE: R22.2 R23.2 ; port HV_SOLAR_RELAY_SENSE
KILL_SWITCH: R18.2 R27.1 ; port KILL_SWITCH
KS_Drain: Q2.2(S) Q3.2(S) Q4.2(S) Q5.3(D)
PA15_KILL_SWITCH_MNTR: R18.1 R21.2 ; port PA15_KILL_SWITCH_MNTR
PB3_HV_NEG_RELAY_SENSE: C12.2 R16.1 ; port PB3_HV_NEG_RELAY_SENSE
PB4_HV_NEG_RELAY_EN: R26.1 ; port PB4_HV_NEG_RELAY_EN
PB5_HV_POS_RELAY_SENSE: C13.2 R19.1 ; port PB5_HV_POS_RELAY_SENSE
PB8_HV_POS_RELAY_EN: R25.1 ; port PB8_HV_POS_RELAY_EN
PB9_HV_SOLAR_RELAY_SENSE: C14.2 R22.1 ; port PB9_HV_SOLAR_RELAY_SENSE
PC13_HV_SOLAR_RELAY_EN: R24.1 ; port PC13_HV_SOLAR_RELAY_EN
NetLED1_2: LED1.2 R11.1
NetLED2_2: LED2.2 R12.1
NetLED4_2: LED4.2 R13.1
NetQ2_1: Q2.1(G) R14.2 R24.2
NetQ3_1: Q3.1(G) R15.2 R25.2
NetQ4_1: Q4.1(G) R26.2 R30.2
NetQ5_1: Q5.1(G) R27.2

### Notes on the sheet
- Relay Control
- Relay Sense
- Kill Switch
- FC = 1.59 KHz
- Project:
- Title:
- Size:
- Project Lead:
- Letter
- Revision:
- University of Waterloo
- 200 University Ave W
- Waterloo, ON, Canada
- N2L 3E9
- Date:
- Sheet
- of
- Website:

### Library data of the parts
C8 C10 C11 = CMP-013-0018-6: as C1 on sheet BMS Carrier - Connectors; Tolerance: 20%; Case/Package: 0603
C12-C14 = CMP-013-0022-14: as C6 on sheet BMS Carrier - Connectors; Case/Package: 0603; Tolerance: 10%
LED1 LED2 LED4 = CMP-011-0001-9: Green 562nm LED Indication - Discrete 2V 0603 (1608 Metric); Forward Current: 20mA; Case/Package: 0603 (1608 Metric); Colour: Green; Forward Voltage: 2V
Q2-Q5 = CMP-003-0074-4: N-Channel 30V 6.2A (Ta) 900mW (Ta) Surface Mount SOT-23; Vgs (Max): 20V; Vgs(th) (Max) @ Id: 1.8; Case/Package: SOT 23-3; Power: 900mW
R11-R15 R17 R20 R23 R30 = CMP-009-00190-14: as R3 on sheet BMS Carrier - Connectors; Case/Package: 0603
R16 R19 R22 = CMP-009-00014-17: 1 kOhms ±1% 0.1W, 1/10W Chip Resistor 0603 (1608 Metric) Moisture Resistant Thick Film; Voltage Rating: 75V; Temperature Coefficient: 100ppm/°C; Case/Package: 0603
R18 = CMP-010-0022-7: 255k Ohm ±1% 0.1W, 1/10W Chip Resistor 0603 (1608 Metric) Moisture Resistant Thick Film; Voltage Rating: 75V; Temperature Coefficient: 100ppm/°C; Case/Package: 0603
R21 = CMP-00026-1: Fixed Resistor, Metal Glaze/thick Film, 0.1W, 75000ohm, 75V, 1% +/-Tol, 100ppm/Cel, Surface Mount, 0603; Temperature Coefficient: 100ppm/°C; Case/Package: 0603; Voltage Rating: 75V
R24-R27 = CMP-009-00193-9: Fixed Resistor, Metal Glaze/thick Film, 0.1W, 22.1ohm, 75V, 1% +/-Tol, 100ppm/Cel, Surface Mount, 0603; Temperature Coefficient: 100ppm/°C; Case/Package: 0603; Voltage Rating: 75V

## Nets that join several sheets
3V3: BMS Carrier - Connectors (8 pins), BMS Carrier - AFE Interface (12 pins)
3V3_ISO: BMS Carrier - Connectors (P10.6 R34.2 R35.2), BMS Carrier - AFE Interface (C5.2 R9.2 U1.4 U3.8)
12V: BMS Carrier - Connectors (8 pins), BMS Carrier - AFE Interface (C17.2 U5.3)
12V_AUX: BMS Carrier - Connectors (6 pins), BMS Carrier - Battery Relay Controls (6 pins)
GND: BMS Carrier - Connectors (15 pins), BMS Carrier - AFE Interface (20 pins), BMS Carrier - Battery Relay Controls (14 pins)
ISO_GND: BMS Carrier - Connectors (P10.3), BMS Carrier - AFE Interface (C5.1 U1.3 U3.5)
5V_AFE1: BMS Carrier - Connectors (P13.1), BMS Carrier - AFE Interface (C7.2 U4.10)
5V_AFE2: BMS Carrier - Connectors (P14.1), BMS Carrier - AFE Interface (C16.2 U4.8)
5V_AFE3: BMS Carrier - Connectors (P15.1), BMS Carrier - AFE Interface (C19.2 U4.5)
AFE_ISOSPI_N: BMS Carrier - Connectors (P4.1), BMS Carrier - AFE Interface (T1.4)
AFE_ISOSPI_P: BMS Carrier - Connectors (P4.2), BMS Carrier - AFE Interface (T1.5)
CS_ALRT_ISO: BMS Carrier - Connectors (P10.4), BMS Carrier - AFE Interface (Q1.2)
GND_AFE1: BMS Carrier - Connectors (P13.2), BMS Carrier - AFE Interface (C7.1 U4.11)
GND_AFE2: BMS Carrier - Connectors (P14.2), BMS Carrier - AFE Interface (C16.1 U4.9)
GND_AFE3: BMS Carrier - Connectors (P15.2), BMS Carrier - AFE Interface (C19.1 U4.4)
HV_NEG_RELAY_GND: BMS Carrier - Connectors (P6.4), BMS Carrier - Battery Relay Controls (LED4.1 Q4.3)
HV_NEG_RELAY_SENSE: BMS Carrier - Connectors (P6.2), BMS Carrier - Battery Relay Controls (R16.2 R17.2)
HV_POS_RELAY_GND: BMS Carrier - Connectors (P5.4), BMS Carrier - Battery Relay Controls (LED2.1 Q3.3)
HV_POS_RELAY_SENSE: BMS Carrier - Connectors (P5.2), BMS Carrier - Battery Relay Controls (R19.2 R20.2)
HV_SOLAR_RELAY_GND: BMS Carrier - Connectors (P7.4), BMS Carrier - Battery Relay Controls (LED1.1 Q2.3)
HV_SOLAR_RELAY_SENSE: BMS Carrier - Connectors (P7.2), BMS Carrier - Battery Relay Controls (R22.2 R23.2)
I2C_SCL_ISO: BMS Carrier - Connectors (P10.1 R35.1), BMS Carrier - AFE Interface (U3.6)
I2C_SDA_ISO: BMS Carrier - Connectors (P10.2 R34.1), BMS Carrier - AFE Interface (U3.7)
KILL_SWITCH: BMS Carrier - Connectors (P3.1 R36.1), BMS Carrier - Battery Relay Controls (R18.2 R27.1)
PA7_CS_ALRT: BMS Carrier - Connectors (P1.23), BMS Carrier - AFE Interface (Q1.3 R10.2)
PA15_KILL_SWITCH_MNTR: BMS Carrier - Connectors (P1.46), BMS Carrier - Battery Relay Controls (R18.1 R21.2)
PB3_HV_NEG_RELAY_SENSE: BMS Carrier - Connectors (P1.45), BMS Carrier - Battery Relay Controls (C12.2 R16.1)
PB4_HV_NEG_RELAY_EN: BMS Carrier - Connectors (P1.44), BMS Carrier - Battery Relay Controls (R26.1)
PB5_HV_POS_RELAY_SENSE: BMS Carrier - Connectors (P1.43), BMS Carrier - Battery Relay Controls (C13.2 R19.1)
PB8_HV_POS_RELAY_EN: BMS Carrier - Connectors (P1.39), BMS Carrier - Battery Relay Controls (R25.1)
PB9_HV_SOLAR_RELAY_SENSE: BMS Carrier - Connectors (P1.38), BMS Carrier - Battery Relay Controls (C14.2 R22.1)
PB10_I2C_SCL: BMS Carrier - Connectors (P1.16 R2.1), BMS Carrier - AFE Interface (P12.1 U3.3)
PB11_I2C_SDA: BMS Carrier - Connectors (P1.15 R1.1), BMS Carrier - AFE Interface (P12.2 U3.2)
PB12_SPI2_NSS: BMS Carrier - Connectors (P1.13), BMS Carrier - AFE Interface (P11.4 U2.5)
PB13_SPI2_SCK: BMS Carrier - Connectors (P1.12), BMS Carrier - AFE Interface (P11.3 U2.4)
PB14_SPI2_MISO: BMS Carrier - Connectors (P1.11), BMS Carrier - AFE Interface (P11.2 R31.2 U2.3)
PB15_SPI2_MOSI: BMS Carrier - Connectors (P1.10), BMS Carrier - AFE Interface (P11.1 U2.2)
PC13_HV_SOLAR_RELAY_EN: BMS Carrier - Connectors (P1.37), BMS Carrier - Battery Relay Controls (R24.1)